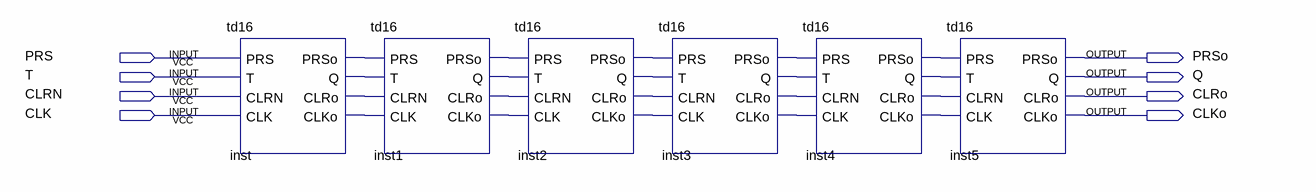
[diagram p0: schematic sheet]
// Quartus schematic td16777216.bdf as structural Verilog: 6 symbols, 8 pins
module td16777216 (
  input  PRS,
  input  T,
  input  CLRN,
  input  CLK,
  output PRSo,
  output Q,
  output CLRo,
  output CLKo
);

  wire inst1_clko, inst1_clro, inst1_prso, inst1_q, inst2_clko, inst2_clro, inst2_prso, inst2_q, inst3_clko,
       inst3_clro, inst3_prso, inst3_q, inst4_clko, inst4_clro, inst4_prso, inst4_q, inst_clko, inst_clro,
       inst_prso, inst_q;

  td16 inst (
    .PRS(PRS), .T(T), .CLRN(CLRN), .CLK(CLK), .PRSo(inst_prso), .Q(inst_q), .CLRo(inst_clro), .CLKo(inst_clko));
  td16 inst1 (
    .PRS(inst_prso), .T(inst_q), .CLRN(inst_clro), .CLK(inst_clko), .PRSo(inst1_prso), .Q(inst1_q),
    .CLRo(inst1_clro), .CLKo(inst1_clko));
  td16 inst2 (
    .PRS(inst1_prso), .T(inst1_q), .CLRN(inst1_clro), .CLK(inst1_clko), .PRSo(inst2_prso), .Q(inst2_q),
    .CLRo(inst2_clro), .CLKo(inst2_clko));
  td16 inst3 (
    .PRS(inst2_prso), .T(inst2_q), .CLRN(inst2_clro), .CLK(inst2_clko), .PRSo(inst3_prso), .Q(inst3_q),
    .CLRo(inst3_clro), .CLKo(inst3_clko));
  td16 inst4 (
    .PRS(inst3_prso), .T(inst3_q), .CLRN(inst3_clro), .CLK(inst3_clko), .PRSo(inst4_prso), .Q(inst4_q),
    .CLRo(inst4_clro), .CLKo(inst4_clko));
  td16 inst5 (
    .PRS(inst4_prso), .T(inst4_q), .CLRN(inst4_clro), .CLK(inst4_clko), .PRSo(PRSo), .Q(Q), .CLRo(CLRo),
    .CLKo(CLKo));
endmodule
